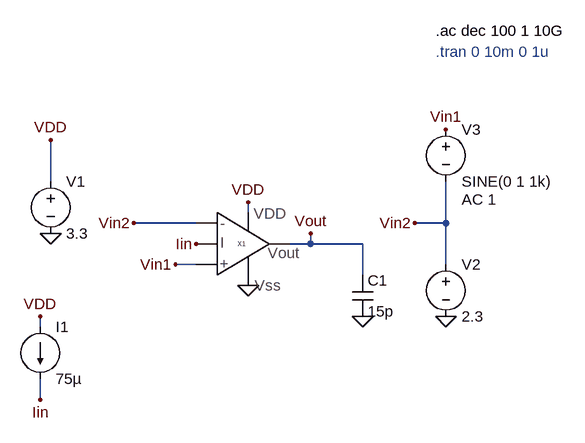
[diagram p0: schematic SimProyecto.asc]
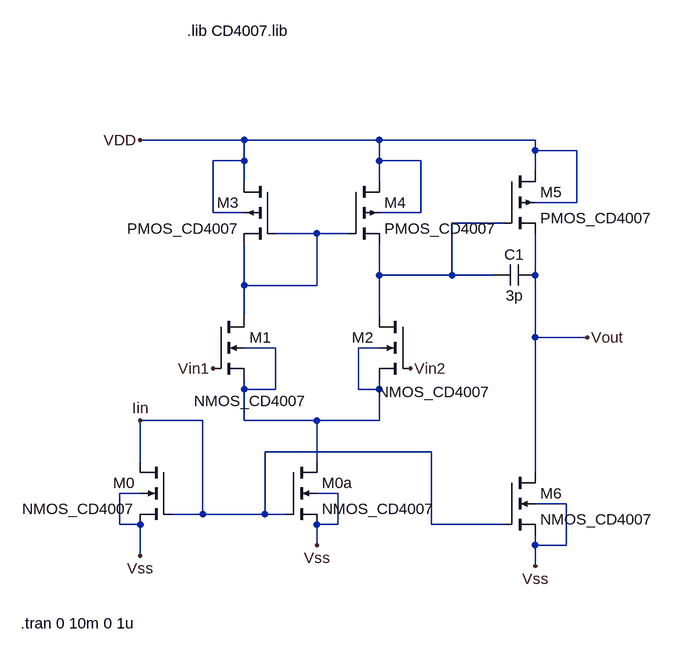
[diagram p1: sub-circuit amplificador.asc]
SimProyecto.asc, the LTspice schematic file:
Version 4
SHEET 1 880 680
WIRE -48 32 -48 -32
WIRE 256 80 256 64
WIRE 176 96 80 96
WIRE 560 96 560 32
WIRE 560 96 512 96
WIRE 352 128 352 112
WIRE 352 128 320 128
WIRE 432 128 352 128
WIRE 176 160 144 160
WIRE 560 160 560 96
WIRE 432 176 432 128
WIRE -64 256 -64 240
WIRE -64 368 -64 336
FLAG 80 96 Vin2
FLAG 176 128 Iin
FLAG 352 112 Vout
FLAG -64 368 Iin
FLAG -64 240 VDD
FLAG -48 -32 VDD
FLAG 560 -48 Vin1
FLAG 512 96 Vin2
FLAG 560 240 0
FLAG -48 112 0
FLAG 432 240 0
FLAG 256 192 0
FLAG 256 64 VDD
FLAG 144 160 Vin1
SYMBOL Amplificador 240 128 R0
WINDOW 0 0 0 Left 0
WINDOW 39 0 0 Left 0
SYMATTR InstName X1
SYMBOL voltage -48 16 R0
SYMATTR InstName V1
SYMATTR Value 3.3
SYMBOL voltage 560 144 R0
SYMATTR InstName V2
SYMATTR Value 2.3
SYMBOL voltage 560 -64 R0
WINDOW 123 24 124 Left 2
WINDOW 39 0 0 Left 0
SYMATTR Value2 AC 1
SYMATTR InstName V3
SYMATTR Value SINE(0 1 1k)
SYMBOL current -64 256 R0
SYMATTR InstName I1
SYMATTR Value 75µ
SYMBOL cap 416 176 R0
SYMATTR InstName C1
SYMATTR Value 15p
TEXT 544 -200 Left 2 !.ac dec 100 1 10G
TEXT 544 -168 Left 2 ;.tran 0 10m 0 1u

amplificador.asc, the sub-circuit schematic file:
Version 4
SHEET 1 1364 680
WIRE 160 -288 0 -288
WIRE 368 -288 160 -288
WIRE 608 -288 368 -288
WIRE 608 -272 608 -288
WIRE 672 -272 608 -272
WIRE 160 -256 160 -288
WIRE 160 -256 112 -256
WIRE 368 -256 368 -288
WIRE 432 -256 368 -256
WIRE 608 -240 608 -272
WIRE 160 -224 160 -256
WIRE 368 -224 368 -256
WIRE 672 -192 672 -272
WIRE 672 -192 608 -192
WIRE 112 -176 112 -256
WIRE 160 -176 112 -176
WIRE 432 -176 432 -256
WIRE 432 -176 368 -176
WIRE 560 -160 480 -160
WIRE 272 -144 208 -144
WIRE 320 -144 272 -144
WIRE 368 -80 368 -128
WIRE 480 -80 480 -160
WIRE 480 -80 368 -80
WIRE 544 -80 480 -80
WIRE 608 -80 608 -144
WIRE 160 -64 160 -128
WIRE 272 -64 272 -144
WIRE 272 -64 160 -64
WIRE 160 -16 160 -64
WIRE 368 -16 368 -80
WIRE 608 16 608 -80
WIRE 688 16 608 16
WIRE 208 32 160 32
WIRE 368 32 336 32
WIRE 160 96 160 80
WIRE 208 96 208 32
WIRE 208 96 160 96
WIRE 336 96 336 32
WIRE 368 96 368 80
WIRE 368 96 336 96
WIRE 96 144 0 144
WIRE 160 144 160 96
WIRE 272 144 160 144
WIRE 368 144 368 96
WIRE 368 144 272 144
WIRE 448 192 192 192
WIRE 0 208 0 144
WIRE 272 208 272 144
WIRE 608 224 608 16
WIRE 0 256 -32 256
WIRE 304 256 272 256
WIRE 656 272 608 272
WIRE 96 288 96 144
WIRE 96 288 48 288
WIRE 192 288 192 192
WIRE 192 288 96 288
WIRE 224 288 192 288
WIRE -32 304 -32 256
WIRE 0 304 -32 304
WIRE 304 304 304 256
WIRE 304 304 272 304
WIRE 448 304 448 192
WIRE 560 304 448 304
WIRE 272 336 272 304
WIRE 608 336 608 320
WIRE 656 336 656 272
WIRE 656 336 608 336
WIRE 0 352 0 304
WIRE 608 368 608 336
FLAG 0 352 Vss
FLAG 272 336 Vss
FLAG 608 368 Vss
FLAG 0 -288 VDD
FLAG 416 64 Vin2
FLAG 112 64 Vin1
FLAG 0 144 Iin
FLAG 688 16 Vout
SYMBOL pmos4 208 -224 M0
SYMATTR InstName M3
SYMATTR Value PMOS_CD4007
SYMATTR Value2 L=5u W=360u Ad=18000p As=18000p Pd=820u Ps=820u NRS=0.54 NRD=0.54
SYMBOL pmos4 320 -224 R0
SYMATTR InstName M4
SYMATTR Value PMOS_CD4007
SYMATTR Value2 L=5u W=360u Ad=18000p As=18000p Pd=820u Ps=820u NRS=0.54 NRD=0.54
SYMBOL pmos4 560 -240 R0
SYMATTR InstName M5
SYMATTR Value PMOS_CD4007
SYMATTR Value2 L=5u W=360u Ad=18000p As=18000p Pd=820u Ps=820u NRS=0.54 NRD=0.54
SYMBOL cap 544 -64 R270
WINDOW 0 32 32 VTop 2
WINDOW 3 0 32 VBottom 2
SYMATTR InstName C1
SYMATTR Value 3p
SYMBOL nmos4 112 -16 R0
WINDOW 3 -29 130 Left 2
SYMATTR InstName M1
SYMATTR Value NMOS_CD4007
SYMATTR Value2 L=5u W=170u Ad=8500p As=8500p Pd=440u Ps=440u NRD=0.1 NRS=0.1
SYMBOL nmos4 416 -16 M0
WINDOW 3 -124 116 Left 2
SYMATTR InstName M2
SYMATTR Value NMOS_CD4007
SYMATTR Value2 L=5u W=170u Ad=8500p As=8500p Pd=440u Ps=440u NRD=0.1 NRS=0.1
SYMBOL nmos4 48 208 M0
SYMATTR InstName M0
SYMATTR Value NMOS_CD4007
SYMATTR Value2 L=5u W=170u Ad=8500p As=8500p Pd=440u Ps=440u NRD=0.1 NRS=0.1
SYMBOL nmos4 224 208 R0
SYMATTR InstName M0a
SYMATTR Value NMOS_CD4007
SYMATTR Value2 L=5u W=170u Ad=8500p As=8500p Pd=440u Ps=440u NRD=0.1 NRS=0.1
SYMBOL nmos4 560 224 R0
SYMATTR InstName M6
SYMATTR Value NMOS_CD4007
SYMATTR Value2 L=5u W=170u Ad=8500p As=8500p Pd=440u Ps=440u NRD=0.1 NRS=0.1
TEXT 72 -456 Left 2 !.lib CD4007.lib
TEXT -184 456 Left 2 !.tran 0 10m 0 1u

The netlist it stands for:
* SimProyecto.asc
XX1 Vin2 Iin Vin1 VDD Vout 0 amplificador
V1 VDD 0 3.3
V2 Vin2 0 2.3
V3 Vin1 Vin2 SINE(0 1 1k) AC 1
I1 VDD Iin 75µ
C1 Vout 0 15p

* block symbol definitions
.subckt amplificador Vin2 Iin Vin1 VDD Vout Vss
M3 VDD N002 N002 VDD PMOS_CD4007 L=5u W=360u Ad=18000p As=18000p Pd=820u Ps=820u NRS=0.54 NRD=0.54
M4 VDD N002 N001 VDD PMOS_CD4007 L=5u W=360u Ad=18000p As=18000p Pd=820u Ps=820u NRS=0.54 NRD=0.54
M5 VDD N001 Vout VDD PMOS_CD4007 L=5u W=360u Ad=18000p As=18000p Pd=820u Ps=820u NRS=0.54 NRD=0.54
C1 N001 Vout 3p
M1 N002 Vin1 N003 N003 NMOS_CD4007 L=5u W=170u Ad=8500p As=8500p Pd=440u Ps=440u NRD=0.1 NRS=0.1
M2 N001 Vin2 N003 N003 NMOS_CD4007 L=5u W=170u Ad=8500p As=8500p Pd=440u Ps=440u NRD=0.1 NRS=0.1
M0 Iin Iin Vss Vss NMOS_CD4007 L=5u W=170u Ad=8500p As=8500p Pd=440u Ps=440u NRD=0.1 NRS=0.1
M0a N003 Iin Vss Vss NMOS_CD4007 L=5u W=170u Ad=8500p As=8500p Pd=440u Ps=440u NRD=0.1 NRS=0.1
M6 Vout Iin Vss Vss NMOS_CD4007 L=5u W=170u Ad=8500p As=8500p Pd=440u Ps=440u NRD=0.1 NRS=0.1
.lib CD4007.lib
.tran 0 10m 0 1u
.ends amplificador

.model NMOS NMOS
.model PMOS PMOS
.lib standard.mos
.ac dec 100 1 10G
* .tran 0 10m 0 1u
.backanno
.end